# Altium schematic sheet CP2102.SchDoc
size A
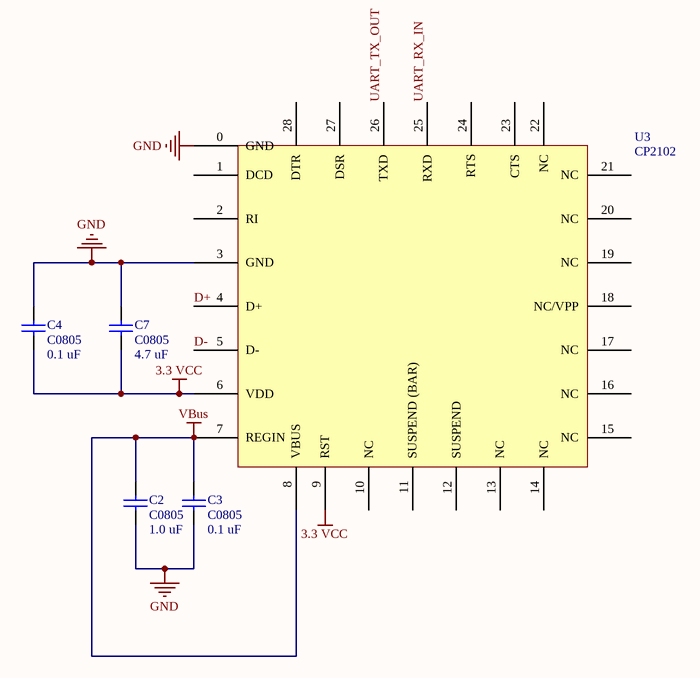
[diagram p0: CP2102.SchDoc]

## Parts
C2  C0805  value 1.0 uF  [0805]
C3  C0805  value 0.1 uF  [0805]
C4  C0805  value 0.1 uF  [0805]
C7  C0805  value 4.7 uF  [0805]
U3  CP2102  [CP2102]

## Nets
3.3 VCC: C4.2 C7.2 U3.6(VDD) U3.9(RST)
GND: C2.1 C3.1 C4.1 C7.1 U3.0(GND) U3.3(GND)
VBus: C2.2 C3.2 U3.7(REGIN) U3.8(VBUS)
D+: U3.4(D+)
D-: U3.5(D-)
UART_RX_IN: U3.25(RXD)
UART_TX_OUT: U3.26(TXD)

Not connected (* = marked no-connect by the designer): U3 1(DCD) 2(RI) 10(NC) 11(SUSPEND_(BAR)) 12(SUSPEND) 13(NC) 14(NC) 15(NC) 16(NC) 17(NC) 18(NC/VPP) 19(NC) 20(NC) 21(NC) 22(NC) 23(CTS) 24(RTS) 27(DSR) 28(DTR)

## Library data of the parts
C2-C4 C7 = C0805: Ceramic Chip Capacitor - Standard; Note: Footprint corresponds to dimensions for bulk cassette packaging. This case size has tightened tolerances.; Published: 17-Jul-2002; LatestRevisionDate: 19-Mar-2004; LatestRevisionNote: Silkscreen size reduced.; DatasheetDocument: Mar-2001; PackageDocument: Mar-2001; PackageReference: 0805; Publisher: Altium Limited; Code_JEITA: 0805; Code_IPC: 2012[0805]; ComponentLink1Description: Manufacturer Link; ComponentLink1URL: http://www.kemet.com/; ComponentLink2Description: Datasheet; ComponentLink2URL: http://www.kemet.com/kemet/web/homepage/kechome.nsf/vapubfilesname/F3102TA.pdf/$file/F3102TA.pdf